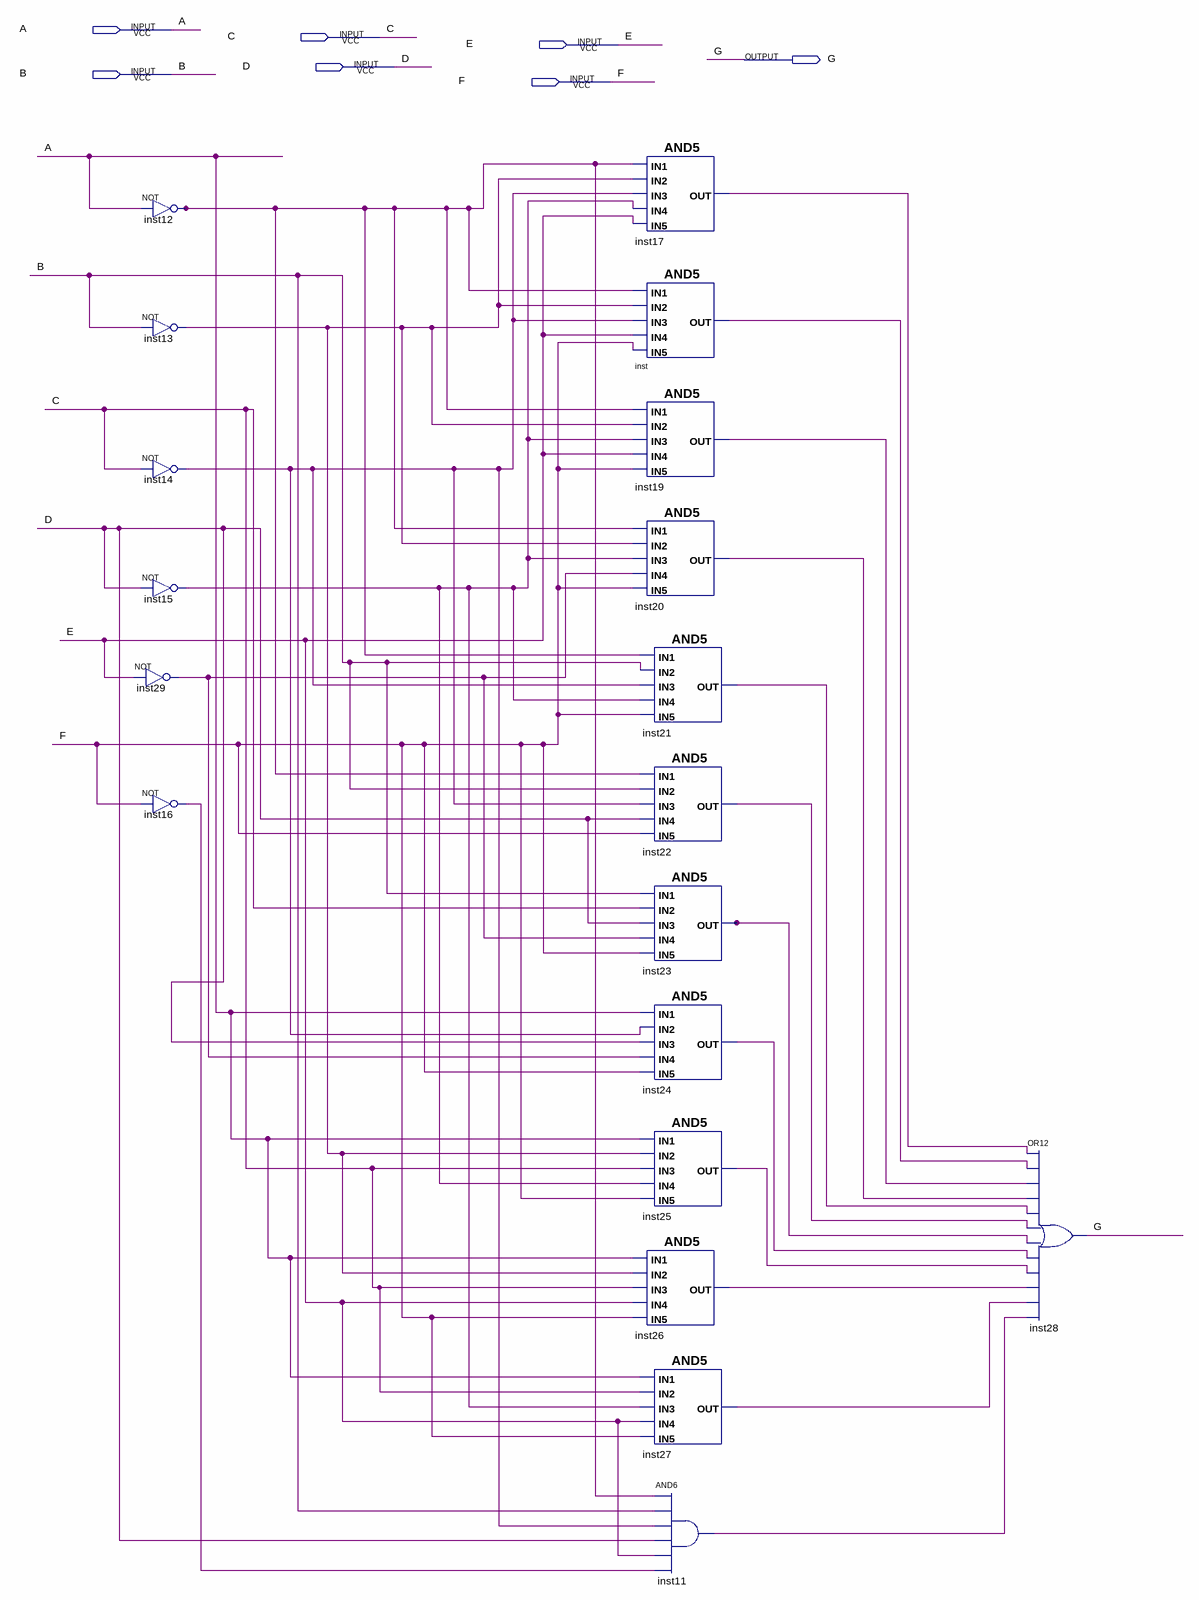
[diagram p0: schematic sheet]
// Quartus schematic prime6.bdf as structural Verilog: 19 symbols, 7 pins
module prime6 (
  input  A,
  input  C,
  input  E,
  input  D,
  input  B,
  input  F,
  output G
);

  wire inst11_out, inst12_out, inst13_out, inst14_out, inst15_out, inst16_out, inst17_out, inst19_out,
       inst20_out, inst21_out, inst22_out, inst23_out, inst24_out, inst25_out, inst26_out, inst27_out,
       inst29_out, inst_out;

  not inst12 (inst12_out, A);
  not inst13 (inst13_out, B);
  not inst14 (inst14_out, C);
  not inst15 (inst15_out, D);
  not inst29 (inst29_out, E);
  not inst16 (inst16_out, F);
  and inst17 (inst17_out, inst12_out, inst13_out, inst14_out, inst15_out, E);
  and inst (inst_out, inst12_out, inst13_out, inst14_out, E, F);
  and inst19 (inst19_out, inst12_out, inst13_out, inst15_out, E, F);
  and inst20 (inst20_out, inst12_out, inst13_out, inst15_out, inst29_out, F);
  and inst26 (inst26_out, A, inst13_out, C, E, F);
  and inst21 (inst21_out, inst12_out, B, inst14_out, inst15_out, F);
  and inst22 (inst22_out, inst12_out, B, inst14_out, D, F);
  and inst23 (inst23_out, B, C, D, inst29_out, F);
  and inst24 (inst24_out, A, inst14_out, D, inst29_out, F);
  and inst25 (inst25_out, A, inst13_out, C, inst15_out, F);
  and inst27 (inst27_out, A, C, inst15_out, E, F);
  and inst11 (inst11_out, inst12_out, B, inst14_out, D, E, inst16_out);
  or inst28 (G, inst17_out, inst_out, inst19_out, inst20_out, inst21_out, inst22_out, inst23_out, inst24_out, inst25_out, inst26_out, inst27_out, inst11_out);
endmodule
